# EAGLE design scroller (EAGLE 4.16)
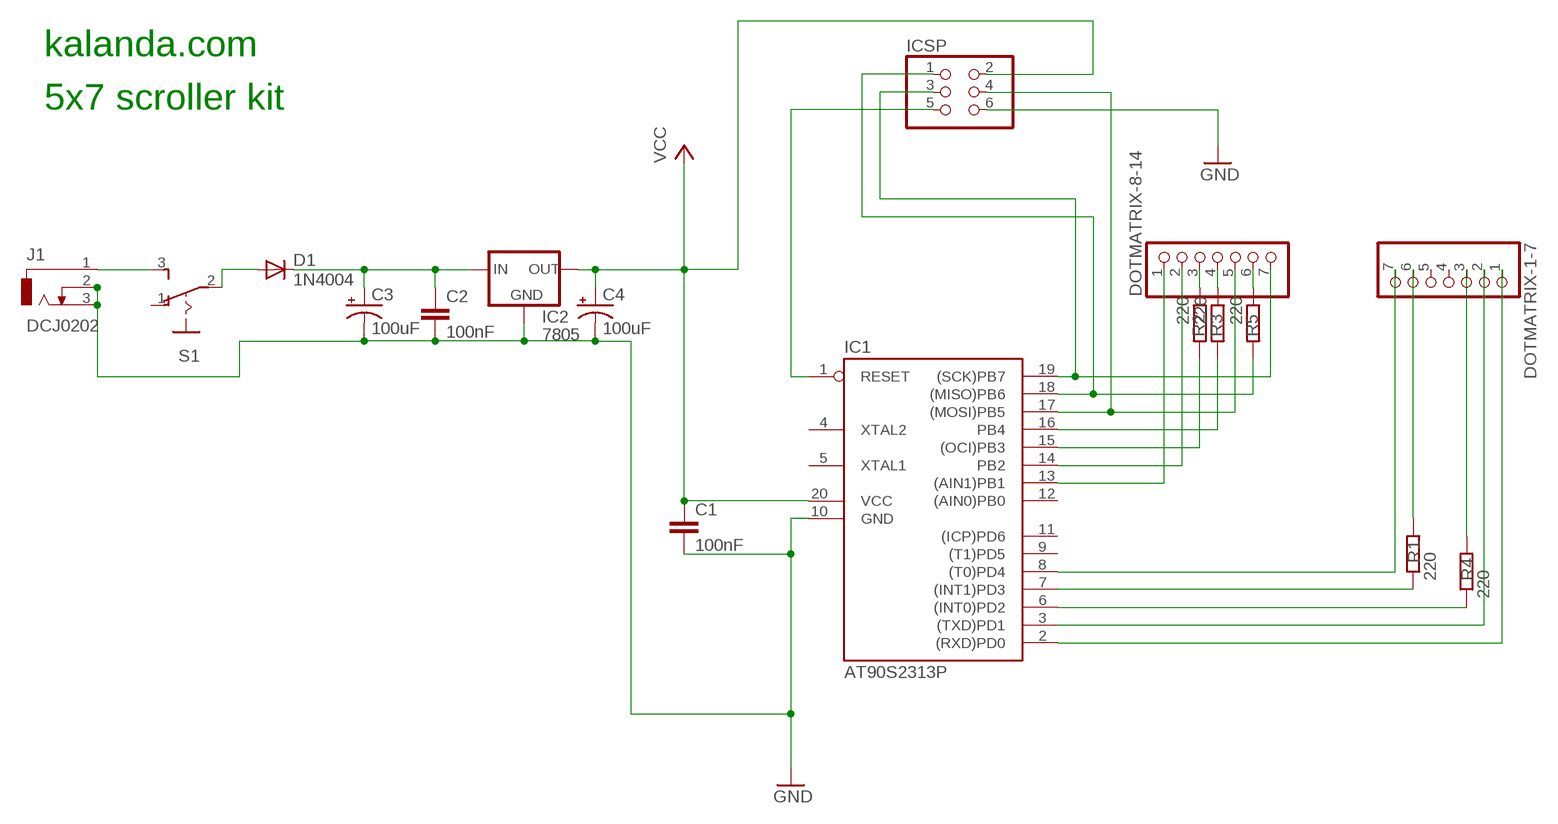
[diagram p0: schematic, sheet 1]

## Parts
C1  100nF  C-EU050-025X075  [C050-025X075]
C2  100nF  C-EU050-025X075  [C050-025X075]
C3  100uF  CPOL-USTT2D5  [TT2D5]
C4  100uF  CPOL-USTT2D5  [TT2D5]
D1  1N4004  [DO41-10]
DOTMATRIX-1-7  PINHD-1X7  [1X07]
DOTMATRIX-8-14  PINHD-1X7  [1X07]
IC1  AT90S2313P  [DIL20]
IC2  7805  78XXL  [78XXL]
ICSP  PINHD-2X3  [2X03]
J1  DCJ0202  [DCJ0202]
R1  220  R-EU_0204/7  [0204/7]
R2  220  R-EU_0204/7  [0204/7]
R3  220  R-EU_0204/7  [0204/7]
R4  220  R-EU_0204/7  [0204/7]
R5  220  R-EU_0204/7  [0204/7]
S1  255SB  [255SB]

## Nets
GND: C1.2 C2.2 C3.- C4.- IC1.10(GND) IC2.GND ICSP.6 J1.2 J1.3
N$1: DOTMATRIX-8-14.7 IC1.19((SCK)PB7) ICSP.3
N$2: IC1.18((MISO)PB6) ICSP.1 R5.2
N$3: DOTMATRIX-8-14.5 IC1.17((MOSI)PB5) ICSP.4
N$4: IC1.16(PB4) R3.2
N$5: IC1.15((OCI)PB3) R2.2
N$6: DOTMATRIX-8-14.2 IC1.14(PB2)
N$7: DOTMATRIX-8-14.1 IC1.13((AIN1)PB1)
N$8: DOTMATRIX-1-7.7 IC1.8((T0)PD4)
N$9: IC1.7((INT1)PD3) R1.1
N$10: IC1.6((INT0)PD2) R4.1
N$11: DOTMATRIX-1-7.2 IC1.3((TXD)PD1)
N$12: DOTMATRIX-1-7.1 IC1.2((RXD)PD0)
N$14: DOTMATRIX-1-7.6 R1.2
N$15: DOTMATRIX-8-14.3 R2.1
N$16: DOTMATRIX-8-14.4 R3.1
N$17: DOTMATRIX-8-14.6 R5.1
N$18: DOTMATRIX-1-7.3 R4.2
N$19: J1.1 S1.3(S)
N$25: D1.A S1.2(P)
N$26: C2.1 C3.+ D1.C IC2.IN
N$29: IC1.1(RESET) ICSP.5
VCC: C1.1 C4.+ IC1.20(VCC) IC2.OUT ICSP.2
Unconnected: DOTMATRIX-1-7.4 DOTMATRIX-1-7.5 IC1.4(XTAL2) IC1.5(XTAL1) IC1.9((T1)PD5) IC1.11((ICP)PD6) IC1.12((AIN0)PB0) S1.1(O)

## Notes on the sheet
- kalanda.com
- 5x7 scroller kit

## Library data of the parts
C1 C2 = rcl:C-EU: CAPACITOR, European symbol
C3 C4 = rcl:CPOL-US: POLARIZED CAPACITOR, American symbol
D1 = -redpic-diode-transistor:1N4004: DIODE general purpose rectifier, 1 A
DOTMATRIX-1-7 DOTMATRIX-8-14 = pinhead:PINHD-1X7: PIN HEADER
IC1 = atmel:AT90S2313: MICROCONTROLLER 2 Kbytes FLASH 128 bytes SRAM 128 bytes EEPROM UART
IC2 = -redpic-basic-components:78XXL: VOLTAGE REGULATOR
ICSP = pinhead:PINHD-2X3: PIN HEADER
J1 = con-jack:DCJ0202: DC POWER JACK Source: DCJ0202.pdf
R1-R5 = rcl:R-EU_: RESISTOR, European symbol
S1 = switch:255SB: SLIDING SWITCH distributor Buerklin, 11G810

## Board
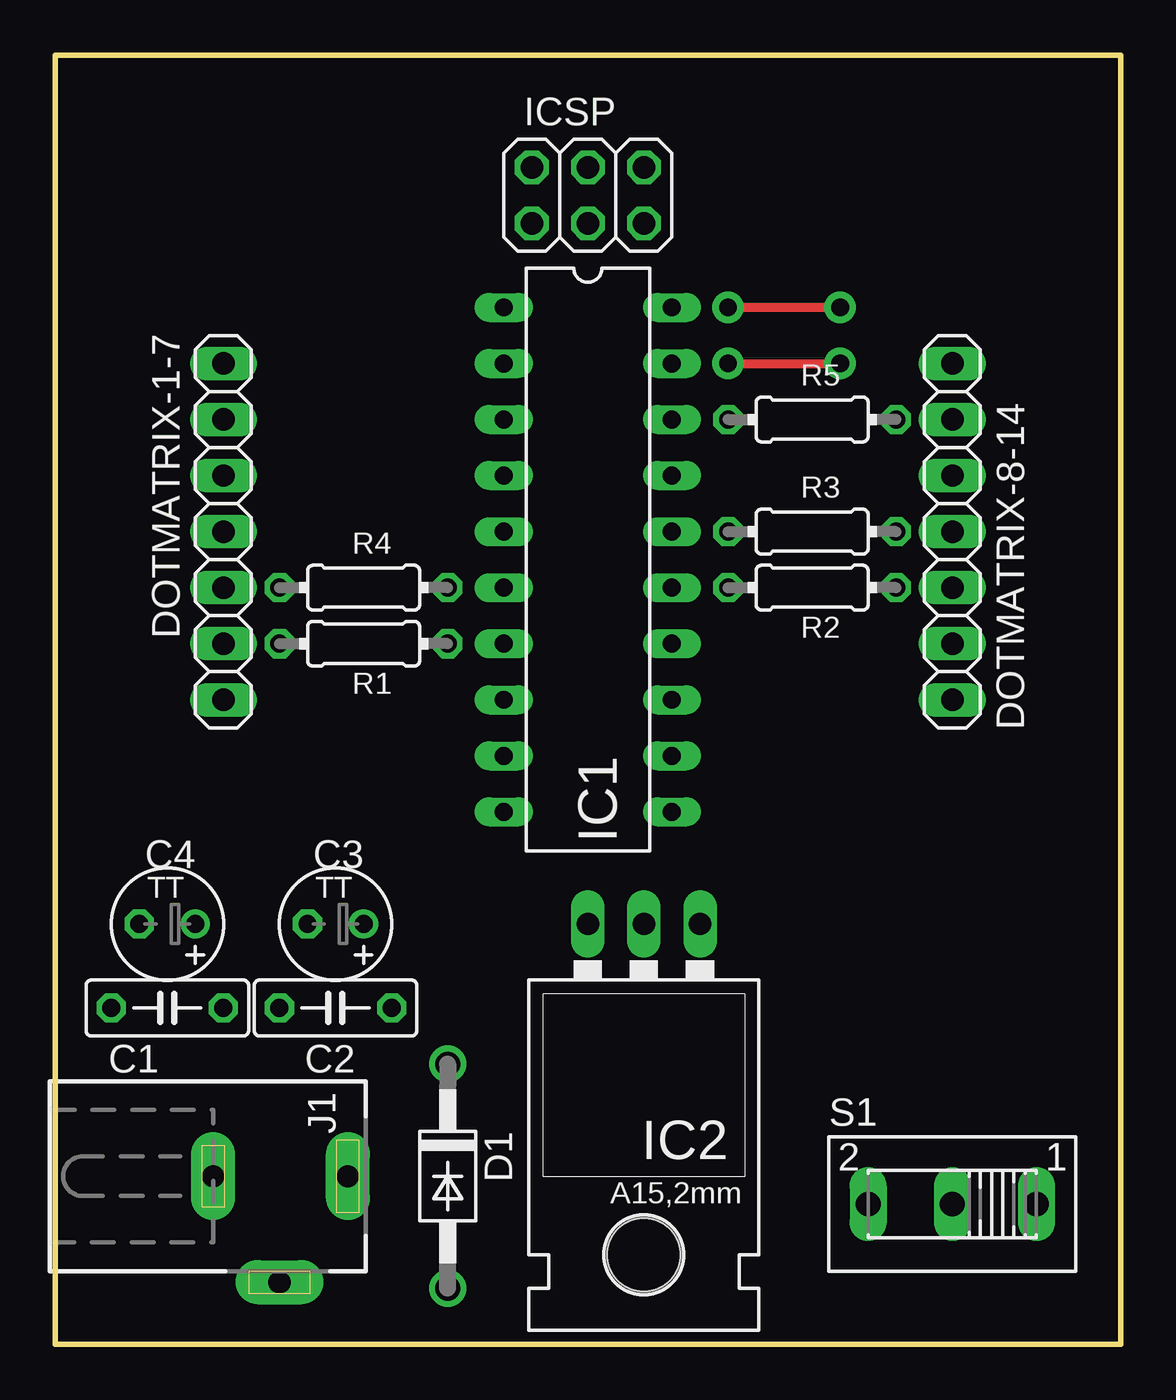
[diagram p1: board, top side]
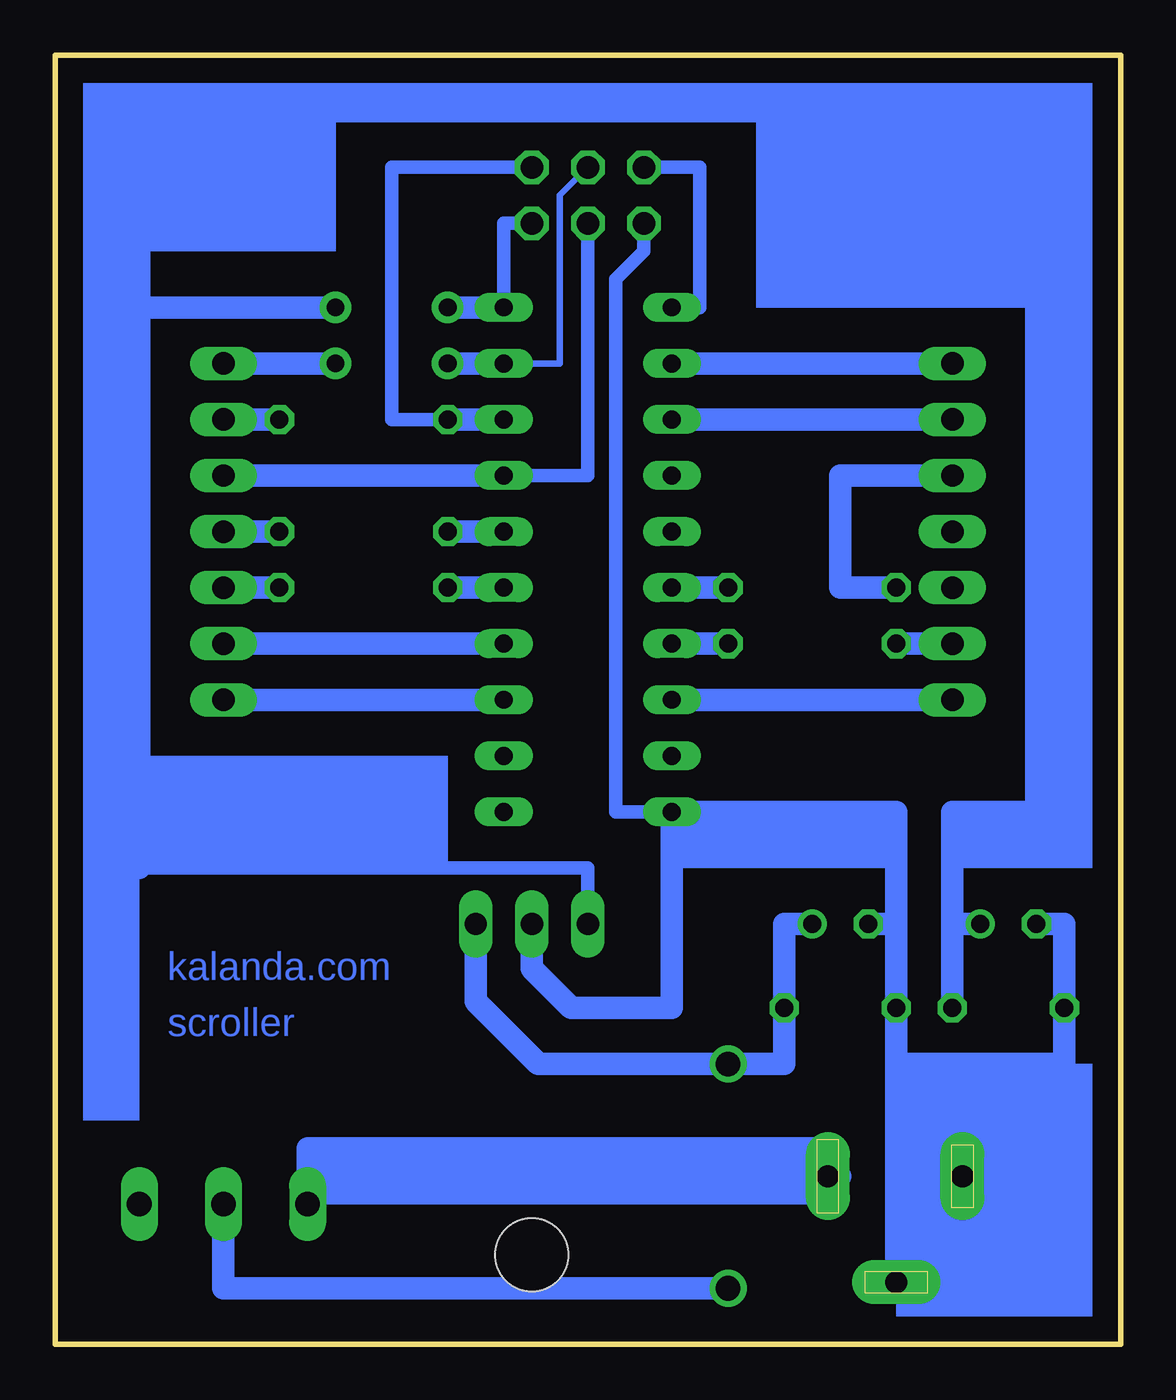
[diagram p2: board, bottom side, seen from below]

Size 48.26 x 58.42 mm. Coordinates in mm from the lower left corner, seen from the top.
Outline: 0,58.42 0,0 48.26,0 48.26,58.42 0,58.42
Copper layers (1*16): Top 0.035mm / dielectric 1.5mm / Bottom 0.035mm
Design rules "default": minimum track width 10mil, minimum drill 24mil, track to track 8mil, track to pad 8mil, pad to pad 8mil, via to via 8mil, smd to smd 8mil, copper to edge 40mil, drill to drill 8mil, minimum pad ring 10mil, minimum via ring 8mil, stop-mask expansion 4mil, vias tented up to drill 0mil, thermal gap 10mil

### Footprints (pad centres in the part's own frame; a part is rotated, then mirrored left to right if it is on the bottom)
C050-025X075 = drill 0.813 octagon: 1 -2.54,0; 2 2.54,0
TT2D5 = drill 0.813 round: + -1.27,0 | drill 0.813 octagon: - 1.27,0
DO41-10 = drill 1.118 round: A 5.08,0; C -5.08,0
1X07 = drill 1.016 long: 1 -7.62,0; 2 -5.08,0; 3 -2.54,0; 4 0,0; 5 2.54,0; 6 5.08,0; 7 7.62,0
DIL20 = drill 0.813 long: 1 -11.43,-3.81; 2 -8.89,-3.81; 3 -6.35,-3.81; 4 -3.81,-3.81; 5 -1.27,-3.81; 6 1.27,-3.81; 7 3.81,-3.81; 8 6.35,-3.81; 9 8.89,-3.81; 10 11.43,-3.81; 11 11.43,3.81; 12 8.89,3.81; 13 6.35,3.81; 14 3.81,3.81; 15 1.27,3.81; 16 -1.27,3.81; 17 -3.81,3.81; 18 -6.35,3.81; 19 -8.89,3.81; 20 -11.43,3.81
78XXL = drill 1.016 long: GND 0,-3.81; IN -2.54,-3.81; OUT 2.54,-3.81 | hole 3.302: 0,11.176
2X03 = drill 1.016 octagon: 1 -2.54,-1.27; 2 -2.54,1.27; 3 0,-1.27; 4 0,1.27; 5 2.54,-1.27; 6 2.54,1.27
DCJ0202 = drill 1 pad 2 long: 1 0,3.1; 2 4.8,0; 3 0,-3
0204/7 = drill 0.813 octagon: 1 -3.81,0; 2 3.81,0
255SB = drill 1.118 long: 1 -3.81,0; 2 0,0; 3 3.81,0

### Placement (x,y rotation side)
C1  5.08,15.24 180 top
C2  12.7,15.24 180 top
C3  12.7,19.05 180 top
C4  5.08,19.05 180 top
D1  17.78,7.62 270 top
DOTMATRIX-1-7  7.62,36.83 270 top
DOTMATRIX-8-14  40.64,36.83 90 top
IC1  24.13,35.56 270 top
IC2  26.67,15.24 180 top
ICSP  24.13,52.07 180 top
J1  10.16,7.62 270 top
R1  13.97,31.75 180 top
R2  34.29,34.29 180 top
R3  34.29,36.83 180 top
R4  13.97,34.29 180 top
R5  34.29,41.91 180 top
S1  40.64,6.35 180 top

### Tracks (layer width: path | path; a pad name or v marks a point on that pad's centre or on a via)
GND
  Bottom 0.61: ICSP.6 21.59,49.53 22.86,48.26 22.86,24.13 IC1.10
  Bottom 1.016: 10.16,19.05 10.16,24.13 IC1.10 20.32,15.24 24.87,15.24 26.67,17.04 IC2.GND | 10.16,19.05 C3.- | 10.16,19.05 C2.2 10.16,12.7 | C4.- 2.54,19.05 C1.2 2.54,12.7 10.16,12.7 | 10.16,2.54 J1.2 10.16,6.35 | J1.3 10.16,7.62 10.16,6.35 | 10.16,6.35 10.16,12.7
N$1  (via drill 0.8 pad 1.42)
  Top 0.406: v30.48,44.45 v35.56,44.45
  Bottom 0.305: ICSP.3 25.4,52.07 25.4,44.45 IC1.19
  Bottom 1.016: IC1.19 v30.48,44.45 | v35.56,44.45 DOTMATRIX-8-14.7
N$2
  Bottom 0.61: ICSP.1 33.02,53.34 33.02,41.91 R5.2
  Bottom 1.016: IC1.18 R5.2
N$3
  Bottom 0.61: ICSP.4 24.13,39.37 IC1.17
  Bottom 1.016: IC1.17 DOTMATRIX-8-14.5
N$4
  Bottom 1.016: IC1.16 R3.2
N$5
  Bottom 1.016: IC1.15 R2.2
N$6
  Bottom 1.016: IC1.14 DOTMATRIX-8-14.2
N$7
  Bottom 1.016: IC1.13 DOTMATRIX-8-14.1
N$8
  Bottom 1.016: DOTMATRIX-1-7.7 IC1.8
N$9
  Bottom 1.016: R1.1 IC1.7
N$10
  Bottom 1.016: R4.1 IC1.6
N$11
  Bottom 1.016: DOTMATRIX-1-7.2 IC1.3
N$12
  Bottom 1.016: DOTMATRIX-1-7.1 IC1.2
N$14
  Bottom 1.016: DOTMATRIX-1-7.6 R1.2
N$15
  Bottom 1.016: R2.1 DOTMATRIX-8-14.3
N$16
  Bottom 1.016: R3.1 DOTMATRIX-8-14.4
N$17
  Bottom 1.016: R5.1 DOTMATRIX-8-14.6
N$18
  Bottom 1.016: DOTMATRIX-1-7.3 12.7,39.37 12.7,34.29 R4.2
N$19
  Bottom 1.016: J1.1 12.7,7.62 13.97,8.89 36.83,8.89 S1.3
N$25
  Bottom 1.016: S1.2 40.64,2.54 D1.A
N$26
  Bottom 1.016: IC2.IN 29.21,15.54 26.37,12.7 D1.C 15.24,12.7 C2.1 15.24,19.05 C3.+
N$29
  Bottom 0.61: IC1.1 19.05,46.99 19.05,53.34 ICSP.5
VCC  (via drill 0.8 pad 1.42)
  Top 0.406: v35.56,46.99 v30.48,46.99
  Bottom 0.61: ICSP.2 27.94,50.8 IC1.20 | IC2.OUT 24.13,21.59 44.45,21.59
  Bottom 1.016: C4.+ 7.62,19.05 | 44.45,46.99 v35.56,46.99 | v30.48,46.99 IC1.20 | 7.62,19.05 7.62,24.13 3.81,24.13 3.81,55.88 44.45,55.88 44.45,46.99 | 7.62,19.05 C1.1 | 44.45,46.99 44.45,21.59
(copper drawn outside any net)
  shapes: Bottom area x10

### Text on the board
Bottom: kalanda.com | scroller